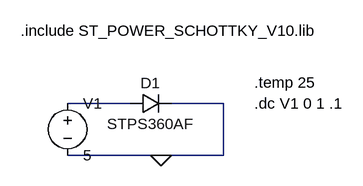
[diagram p0: schematic Q3_1_1.asc]
Q3_1_1.asc, the LTspice schematic file:
Version 4.1
SHEET 1 880 680
WIRE 144 192 48 192
WIRE 288 192 208 192
WIRE 192 272 48 272
WIRE 288 272 288 192
WIRE 288 272 192 272
FLAG 192 272 0
SYMBOL diode 144 208 R270
WINDOW 0 32 32 VTop 2
WINDOW 3 0 32 VBottom 2
SYMATTR InstName D1
SYMATTR Value STPS360AF
SYMBOL voltage 48 176 R0
WINDOW 123 0 0 Left 0
WINDOW 39 0 0 Left 0
SYMATTR InstName V1
SYMATTR Value 5
TEXT -24 80 Left 2 !.include ST_POWER_SCHOTTKY_V10.lib
TEXT 336 192 Left 2 !.dc V1 0 1 .1
TEXT 336 160 Left 2 !.temp 25

The netlist it stands for:
* Q3_1_1.asc
D1 N001 0 STPS360AF
V1 N001 0 5
.model D D
.lib standard.dio
.include ST_POWER_SCHOTTKY_V10.lib
.dc V1 0 1 .1
.temp 25
.backanno
.end